# Altium schematic sheet Controlador de corriente.SchDoc: Levitador magnético
size A4; DocumentNumber: 2; SheetNumber: 2; SheetTotal: 7
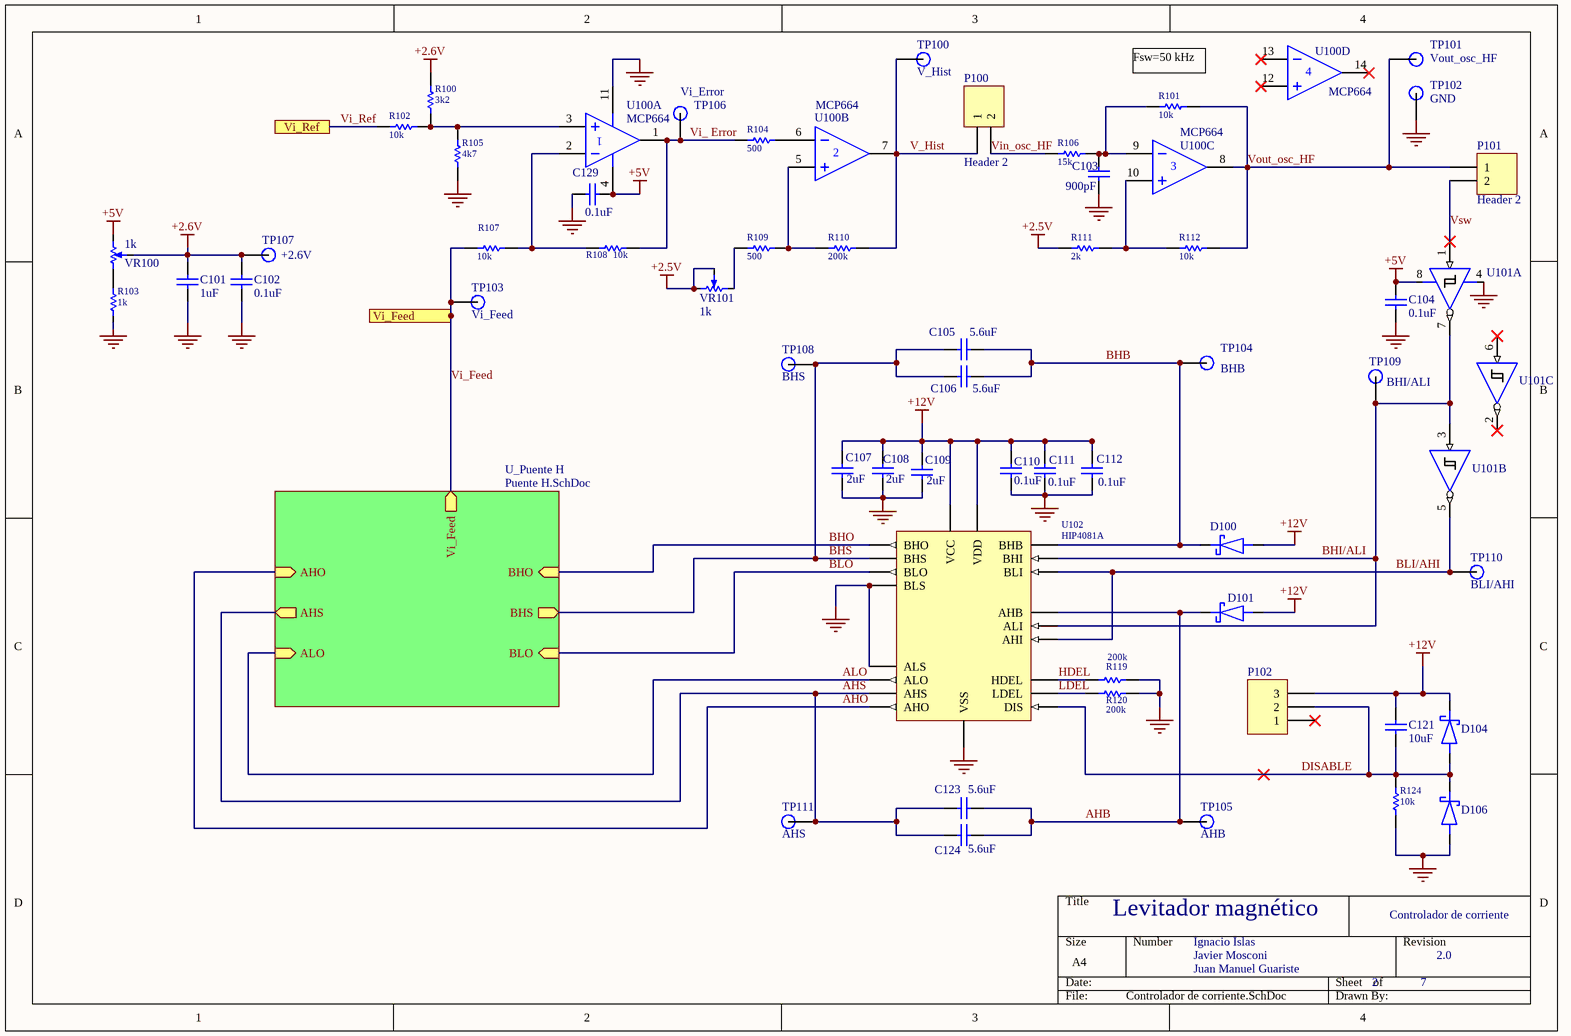
[diagram p0: Controlador de corriente.SchDoc]

## Parts
C101  value 1uF  [C1206]  (hidden comment: Capacitor)
C102  value 0.1uF  [C1206]  (hidden comment: Capacitor)
C103  value 900pF  [C1206]  (hidden comment: Capacitor)
C104  value 0.1uF  [C1206]  (hidden comment: Capacitor)
C105  value 5.6uF  [C1206]  (hidden comment: Capacitor)
C106  value 5.6uF  [C1206]  (hidden comment: Capacitor)
C107  value 2uF  [C1206]  (hidden comment: Capacitor)
C108  value 2uF  [C1206]  (hidden comment: Capacitor)
C109  value 2uF  [C1206]  (hidden comment: Capacitor)
C110  value 0.1uF  [C1206]  (hidden comment: Capacitor)
C111  value 0.1uF  [C1206]  (hidden comment: Capacitor)
C112  value 0.1uF  [C1206]  (hidden comment: Capacitor)
C121  value 10uF  [C1206]  (hidden comment: Capacitor)
C123  value 5.6uF  [C1206]  (hidden comment: Capacitor)
C124  value 5.6uF  [C1206]  (hidden comment: Capacitor)
C129  value 0.1uF  [C1206]  (hidden comment: Capacitor)
D100  RSX205LAM30TR  [SODFL4725X105N]  (value not drawn)
D101  RSX205LAM30TR  [SODFL4725X105N]  (value not drawn)
D104  RSX205LAM30TR  [SODFL4725X105N]  (value not drawn)
D106  RSX205LAM30TR  [SODFL4725X105N]  (value not drawn)
P100  Header 2  [HDR1X2]
P101  Header 2  [HDR1X2]
P102  Header 3  [HDR1X3]  (value not drawn)
R100  3k2  [R1206]
R101  10k  [R1206]
R102  10k  [R1206]
R103  1k  [R1206]
R104  500  [R1206]
R105  4k7  [R1206]
R106  15k  [R1206]
R107  10k  [R1206]
R108  10k  [R1206]
R109  500  [R1206]
R110  200k  [R1206]
R111  2k  [R1206]
R112  10k  [R1206]
R119  200k  [R1206]
R120  200k  [R1206]
R124  10k  [R1206]
TP100  V_Hist  [TestPoint Keystone 5000 Silver-Red]
TP101  Vout_osc_HF  [TestPoint Keystone 5000 Silver-Red]
TP102  GND  [TestPoint Keystone 5000 Silver-Red]
TP103  Vi_Feed  [TestPoint Keystone 5000 Silver-Red]
TP104  BHB  [TestPoint Keystone 5000 Silver-Red]
TP105  AHB  [TestPoint Keystone 5000 Silver-Red]
TP106  Vi_Error  [TestPoint Keystone 5000 Silver-Red]
TP107  +2.6V  [TestPoint Keystone 5000 Silver-Red]
TP108  BHS  [TestPoint Keystone 5000 Silver-Red]
TP109  BHI/ALI  [TestPoint Keystone 5000 Silver-Red]
TP110  BLI/AHI  [TestPoint Keystone 5000 Silver-Red]
TP111  AHS  [TestPoint Keystone 5000 Silver-Red]
U100  MCP664  [SOIC14]  (parts A,B,C,D of 4)
U101  SN74LVC3G06DCUT  [SOP50P310X90-8N]  (value not drawn)  (parts A,B,C of 3)
U102  HIP4081A  [SOIC20]
VR100  value 1k  [3299Y1203LF]  (hidden comment: Trimmer (Thru-Hole))
VR101  value 1k  [3299Y1203LF]  (hidden comment: Trimmer (Thru-Hole))

## Sub-sheets
U_Puente H = Puente H.SchDoc: Vi_Feed (out), BHO (in), BLO (in), AHO (in), ALO (in), BHS (out), AHS (out)

## Ports
Vi_Feed (out), Vi_Ref

## Nets
+2.5V: R111.2 VR101.1(CCW) VR101.2(W)
+2.6V: C101.2 C102.2 R100.2 TP107.1 VR100.2(W)
+5V: C104.2 C129.2 U100.4(V+) U101.8(Vcc) VR100.1(CCW)
+12V: C107.2 C108.2 C109.2 C110.2 C111.2 C112.2 C121.2 D100.2(A) D101.2(A) D104.1(K) P102.3 U102.15(VCC) U102.16(VDD)
GND: C101.1 C102.1 C103.2 C104.1 C107.1 C108.1 C109.1 C110.1 C111.1 C112.1 C129.1 D106.2(A) R103.1 R105.1 R119.2 R120.2 R124.1 TP102.1 U100.11(V-) U101.4(GND) U102.4(VSS) U102.14(ALS) U102.17(BLS)
AHB: C123.2 C124.2 D101.1(K) TP105.1 U102.10(AHB)
AHO: U102.11(AHO) ; sheet U_Puente H/AHO
AHS: C123.1 C124.1 TP111.1 U102.12(AHS) ; sheet U_Puente H/AHS
ALO: U102.13(ALO) ; sheet U_Puente H/ALO
BHB: C105.2 C106.2 D100.1(K) TP104.1 U102.1(BHB)
BHI/ALI: TP109.1 U101.3(2A) U101.7(1Y) U102.2(BHI) U102.6(ALI)
BHO: U102.20(BHO) ; sheet U_Puente H/BHO
BHS: C105.1 C106.1 TP108.1 U102.19(BHS) ; sheet U_Puente H/BHS
BLI/AHI: TP110.1 U101.5(2Y) U102.5(BLI) U102.7(AHI)
BLO: U102.18(BLO) ; sheet U_Puente H/BLO
DISABLE: C121.1 D104.2(A) D106.1(K) P102.2 R124.2 U102.3(DIS)
HDEL: R119.1 U102.8(HDEL)
LDEL: R120.1 U102.9(LDEL)
V_Hist: P100.1 R110.2 TP100.1 U100.7(OUT)
Vi_ Error: R104.1 R108.2 TP106.1 U100.1(OUT)
Vi_Feed: R107.1 TP103.1 ; port Vi_Feed, sheet U_Puente H/Vi_Feed
Vi_Ref: R102.1 ; port Vi_Ref
Vin_osc_HF: P100.2 R106.1
Vout_osc_HF: P101.1 R101.2 R112.2 TP101.1 U100.8(OUT)
Vsw: P101.2 U101.1(1A)
NetC103_1: C103.1 R101.1 R106.2 U100.9(IN-)
NetR100_1: R100.1 R102.2 R105.2 U100.3(IN+)
NetR103_2: R103.2 VR100.3(CW)
NetR104_2: R104.2 U100.6(IN-)
NetR107_2: R107.2 R108.1 U100.2(IN-)
NetR109_1: R109.1 R110.1 U100.5(IN+)
NetR109_2: R109.2 VR101.3(CW)
NetR111_1: R111.1 R112.1 U100.10(IN+)

Not connected (* = marked no-connect by the designer): P102 1*; U100 12(IN+)* 13(IN-)* 14(OUT)*; U101 2(3Y)* 6(3A)*

## Notes on the sheet
- (near R101) Fsw=50 kHz
- Controlador de corriente
- Ignacio Islas
- Javier Mosconi
- Juan Manuel Guariste
- 2.0

## Library data of the parts
C101 = Capacitor: CAP CER 1UF 25V X7R 1206; Mfr PN: GMC31X7R105M25NT; Manufacturer: CAL-CHIP ELECTRONICS, INC.; Supplier 1: Digi-Key; Supplier 1 PN: 2571-GMC31X7R105M25NTTR-ND
C102 C104 C129 = Capacitor: CAP CER 0.1UF 50V X7R 1206; Manufacturer: Venkel; Mfr PN: C1206X7R500-104KNE; Supplier 1: Digi-Key; Supplier 1 PN: 2679-C1206X7R500-104KNETR-ND
C103 = Capacitor: CAP CER 910PF 50V NP0 1206; Mfr PN: C1206C911J5GAC7800; Manufacturer: KEMET; Supplier 1 PN: 399-14715-1-ND; Supplier 1: Digi-Key
C105 C106 C123 C124 = Capacitor: CAP CER 4.7UF 50V X7R 1206; Manufacturer: Samsung Electro-Mechanics; Mfr PN: CL31B475KBHNFNE; Supplier 1: Digi-Key; Supplier 1 PN: 1276-3179-1-ND
C107-C109 = Capacitor: CAP1206 X5R 2.2UF 20% 35V; Mfr PN: GMC31X5R225M35NT; Manufacturer: CAL-CHIP ELECTRONICS, INC.; Supplier 1: Digi-Key; Supplier 1 PN: 2571-GMC31X5R225M35NTTR-ND
C110-C112 = Capacitor: CAP CER 0.1UF 50V X7R 1206; Mfr PN: C1206X7R500-104KNE; Manufacturer: Venkel; Supplier 1: Digi-Key; Supplier 1 PN: 2679-C1206X7R500-104KNETR-ND
C121 = Capacitor: CAP CER 10UF 16V X7R 1206; Manufacturer: CAL-CHIP ELECTRONICS, INC.; Mfr PN: GMC31X7R106M16NT; Supplier 1: Digi-Key; Supplier 1 PN: 2571-GMC31X7R106M16NTTR-ND
D100 D101 D104 D106 = RSX205LAM30TR: DIODE SCHOTTKY 30V 2A PMDTM; Manufacture: ROHM Semiconductor; Datasheet Link: https://fscdn.rohm.com/en/products/databook/datasheet/discrete/diode/schottky_barrier/rsx205lam30tr-e.pdf; Supplier 1 PN: RSX205LAM30CT-ND; Mfr PN: RSX205LAM30TR; Supplier 1: Digi-Key
P100 P101 = Header 2: TERM BLK 2P SIDE ENT 2.54MM PCB; Manufacturer: TE Connectivity AMP Connectors; Mfr PN: 282834-2; Link: https://www.digikey.com/en/products/detail/te-connectivity-amp-connectors/282834-2/1150135; Supplier 1: Digi-Key; Supplier 1 PN: A98333-ND
  P101: LatestRevisionDate: 17-Jul-2002
P102 = Header 3: TERM BLK 3P SIDE ENT 2.54MM PCB; Manufacturer: TE Connectivity AMP Connectors; Mfr PN: 282834-3; Class: Connector; Link: https://www.digikey.com/en/products/detail/te-connectivity-amp-connectors/282834-3/1153264; Supplier 1 PN: A98334-ND; Supplier 1: Digi-Key
R100 = R1206: RES 3.2K OHM 1% 1/4W 1206; Manufacturer: KOA Speer Electronics, Inc.; Mfr PN: RN73H2BTTD3201F25; PackageReference: 1206; Supplier 1: Digi-Key; Value: 3k2; Tolerance: 1%; Supplier 1 PN: 2019-RN73H2BTTD3201F25CT-ND
R101 R102 R107 R108 R112 R124 = R1206: RES 10K OHM 1% 1/4W 1206; Manufacturer: YAGEO; Mfr PN: RC1206FR-0710KL; PackageReference: 1206; Supplier 1: Digi-Key; Value: 10k; Tolerance: 1%; Supplier 1 PN: 311-10.0KFRCT-ND
R103 = R1206: RES 1K OHM 1% 1/4W 1206; Mfr PN: RMCF1206FT1K00; Manufacturer: Stackpole Electronics Inc; Supplier 1 PN: RMCF1206FT1K00CT-ND; Supplier 1: Digi-Key; Value: 1k; Tolerance: 1%
R104 R109 = R1206: RES SMD 500 OHM 0.1% 0.3W 1206; Manufacturer: Vishay Foil Resistors (Division of Vishay Precision Group); Mfr PN: Y1625500R000B9W; PackageReference: 1206; Supplier 1: Digi-Key; Value: 500; Tolerance: 0.1%; Supplier 1 PN: Y1625500R000B9W-ND
R105 = R1206: RES 4.7K OHM 1% 1/4W 1206; Manufacturer: Stackpole Electronics Inc; Mfr PN: RMCF1206FT4K70; PackageReference: 1206; Supplier 1: Digi-Key; Value: 4k7; Tolerance: 1%; Supplier 1 PN: RMCF1206FT4K70CT-ND
R106 = R1206: RES 15K OHM 1% 1/4W 1206; Manufacturer: Vishay Dale; Mfr PN: CRCW120615K0FKEAC; PackageReference: 1206; Supplier 1: Digi-Key; Value: 15k; Tolerance: 1%; Supplier 1 PN: 541-CRCW120615K0FKEACCT-ND
R110 R119 R120 = R1206: RES 200K OHM 1% 1/4W 1206; Manufacturer: YAGEO; Mfr PN: RC1206FR-07200KL; PackageReference: 1206; Supplier 1: Digi-Key; Value: 200k; Tolerance: 1%; Supplier 1 PN: 311-200KFRCT-ND
R111 = R1206: RES 2K OHM 1% 1/4W 1206; Manufacturer: Stackpole Electronics Inc; Mfr PN: RMCF1206FT2K00; PackageReference: 1206; Supplier 1: Digi-Key; Value: 2k; Tolerance: 1%; Supplier 1 PN: RMCF1206FT2K00CT-ND
TP100-TP111 = Testpoint: PC TEST POINT MINIATURE RED; Manufacturer: Keystone Electronics; Mfr PN: 5000; Link: https://www.digikey.com/en/products/detail/keystone-electronics/5000/255326; Supplier 1 PN: 36-5000-ND; Supplier 1: Digi-Key
U100 = MCP664: IC OPAMP GP 4 CIRCUIT 14TSSOP; Mfr PN: MCP664-E/ST; Manufacturer: Microchip Technology; Datasheet: https://ar.mouser.com/datasheet/2/268/20002194E-2448650.pdf; Supplier 1: Digi-Key; Supplier 1 PN: MCP664-E/ST-ND
U101 = SN74LVC3G06DCUT: IC INVERTER OD 3CH 3-INP 8VSSOP; Manufacturer: Texas Instruments; Datasheet Link: http://www.ti.com/lit/gpn/SN74LVC3G06; Mfr PN: SN74LVC3G06DCUT; Supplier 1 PN: 296-46211-1-ND; Supplier 1: Digi-Key
U102 = HIP4081A: IC GATE DRVR HALF-BRIDGE 20SOIC; Mfr PN: HIP4081AIBZ; Manufacturer: Renesas Electronics America Inc; Datasheet: https://www.mouser.jp/datasheet/2/698/hip4081a-1528771.pdf; Supplier 1 PN: HIP4081AIBZ-ND; Supplier 1: Digi-Key
VR100 = Trimmer: e; Mfr PN: 3299Y-1-102LF; Manufacturer: Bourns Inc.; Supplier 1: Digi-Key; Supplier 1 PN: 3299Y-102LF-ND
VR101 = Trimmer: TRIMMER 1K OHM 0.5W PC PIN TOP; Mfr PN: 3299Y-1-102LF; Manufacturer: Bourns Inc.; Supplier 1: Digi-Key; Supplier 1 PN: 3299Y-102LF-ND